# EAGLE schematic TRV_WIZ (EAGLE 6.4)
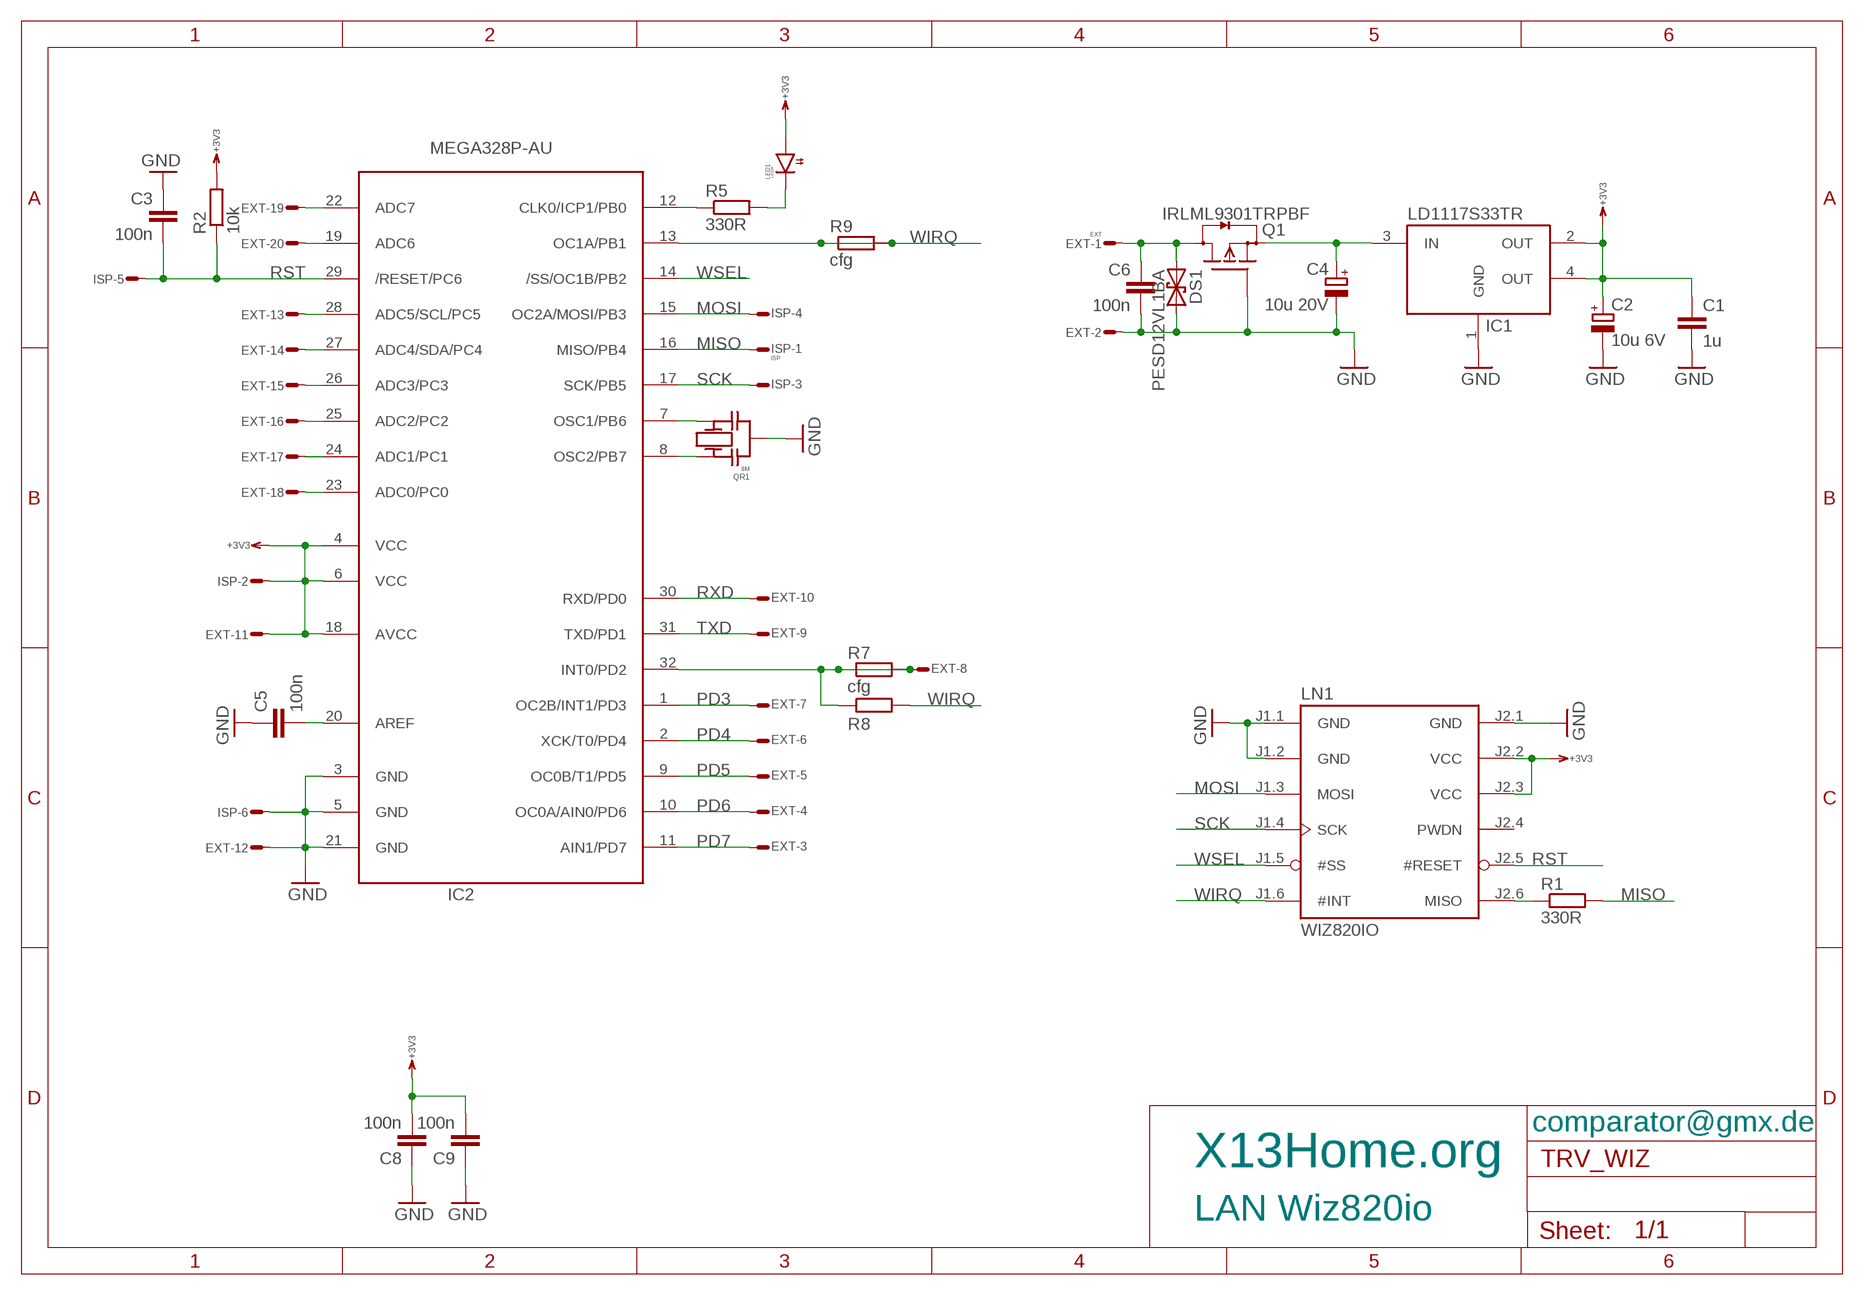
[diagram p0: schematic, sheet 1]

## Parts
C1  1u  C0603  [0603]
C2  10u 6V  C_POLSMCA  [SMC_A]
C3  100n  C0603  [0603]
C4  10u 20V  C_POLSMCB  [SMC_B]
C5  100n  C0603  [0603]
C6  100n  C0603  [0603]
C8  100n  C0603  [0603]
C9  100n  C0603  [0603]
DS1  PESD12VL1BA  TVS-U323  [SOD323]
EXT  EXT  ML20SE  [ML20S]
IC1  LD1117S33TR  LDO_4P  [SOT223]
IC2  MEGA328P-AU  MEGA168PA  [TQFP32-08]
ISP  ISP  ML6ES  [ML6S]
LED1  LEDR  LEDT134  [T1-3/4]
LN1  WIZ820IO  [WIZ820IO]
Q1  IRLML9301TRPBF  FET-PDSOT23  [SOT23]
QR1  8M  QRCE  [CSTCE]
R1  330R  R0603  [0603]
R2  10k  R0603  [0603]
R5  330R  R0603  [0603]
R7  cfg  R0402  [0402]
R8  cfg  R0402  [0402]
R9  cfg  R0402  [0402]

## Nets
+3V3: C1.1 C2.+ C8.2 C9.2 EXT.11 IC1.2(OUT) IC1.4(OUT) IC2.4(VCC) IC2.6(VCC) IC2.18(AVCC) ISP.2 LED1.A LN1.J2.2(VCC) LN1.J2.3(VCC) R2.2
GND: C1.2 C2.- C3.1 C4.- C5.1 C6.2 C8.1 C9.1 DS1.C EXT.2 EXT.12 IC1.1(GND) IC2.3(GND) IC2.5(GND) IC2.21(GND) ISP.6 LN1.J1.1(GND) LN1.J1.2(GND) LN1.J2.1(GND) Q1.1(G) QR1.G(M)
MISO: IC2.16(MISO/PB4) ISP.1 R1.2
MOSI: IC2.15(OC2A/MOSI/PB3) ISP.4 LN1.J1.3(MOSI)
N$1: LN1.J2.6(MISO) R1.1
N$2: C6.1 DS1.A EXT.1 Q1.3(D)
N$3: EXT.19 IC2.22(ADC7)
N$4: C4.+ IC1.3(IN) Q1.2(S)
N$6: C5.2 IC2.20(AREF)
N$7: IC2.8(OSC2/PB7) QR1.A
N$8: IC2.7(OSC1/PB6) QR1.B
N$10: IC2.12(CLK0/ICP1/PB0) R5.1
N$11: EXT.8 IC2.32(INT0/PD2) R7.1 R7.2 R8.1
N$15: EXT.20 IC2.19(ADC6)
N$21: LED1.C R5.2
PC0: EXT.18 IC2.23(ADC0/PC0)
PC1: EXT.17 IC2.24(ADC1/PC1)
PC2: EXT.16 IC2.25(ADC2/PC2)
PC3: EXT.15 IC2.26(ADC3/PC3)
PC4: EXT.14 IC2.27(ADC4/SDA/PC4)
PC5: EXT.13 IC2.28(ADC5/SCL/PC5)
PD3: EXT.7 IC2.1(OC2B/INT1/PD3)
PD4: EXT.6 IC2.2(XCK/T0/PD4)
PD5: EXT.5 IC2.9(OC0B/T1/PD5)
PD6: EXT.4 IC2.10(OC0A/AIN0/PD6)
PD7: EXT.3 IC2.11(AIN1/PD7)
RST: C3.2 IC2.29(/RESET/PC6) ISP.5 LN1.J2.5(#RESET) R2.1
RXD: EXT.10 IC2.30(RXD/PD0)
SCK: IC2.17(SCK/PB5) ISP.3 LN1.J1.4(SCK)
TXD: EXT.9 IC2.31(TXD/PD1)
WIRQ: IC2.13(OC1A/PB1) LN1.J1.6(#INT) R8.2 R9.1 R9.2
WSEL: IC2.14(/SS/OC1B/PB2) LN1.J1.5(#SS)
Unconnected: LN1.J2.4(PWDN)

## Notes on the sheet
- comparator@gmx.de
- X13Home.org
- LAN Wiz820io

## Library data of the parts
C1 C3 C5 C6 C8 C9 = RCL:C: Capacitor SMD
C2 C4 = RCL:C_POL: POLARIZED CAPACITOR, European symbol
DS1 = Diode:TVS-U: DIODE
EXT = Conn:ML20?E: HARTING
IC1 = DCDC:LDO_4P
IC2 = atmel:MEGA168P: MCU, 4/8/16k, TQFP32
ISP = Conn:ML6E: HARTING
LED1 = Optic:LED
LN1 = Other:WIZ820IO
Q1 = Transistor:FET-PD
QR1 = QUARTZ:QR
R1 R2 R5 R7-R9 = RCL:R: Resistor SMD